# Altium schematic sheet Power.SchDoc
size A
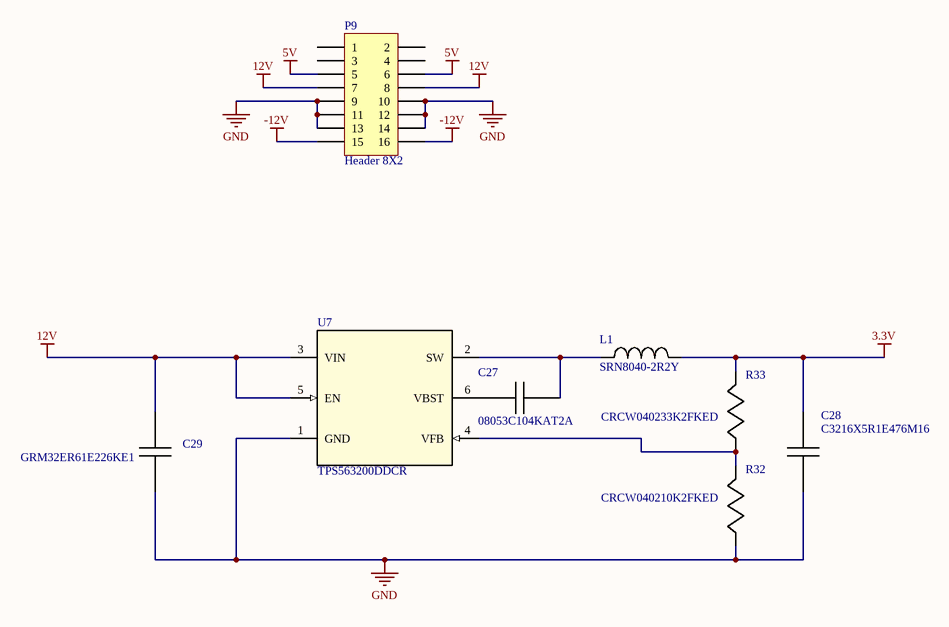
[diagram p0: Power.SchDoc]

## Parts
C27  08053C104KAT2A  [0805]
C28  C3216X5R1E476M16  [1206]
C29  GRM32ER61E226KE1  [1210]
L1  SRN8040-2R2Y  [SRN8040]
P9  Header 8X2  [HDR2X8]
R32  CRCW040210K2FKED  [0402]
R33  CRCW040233K2FKED  [0402]
U7  TPS563200DDCR  [DDC0006A]

## Nets
3.3V: C28.1 L1.2 R33.1
5V: P9.5 P9.6
12V: C29.1 P9.7 P9.8 U7.3(VIN) U7.5(EN)
-12V: P9.15 P9.16
GND: C28.2 C29.2 P9.9 P9.10 P9.11 P9.12 P9.13 P9.14 R32.2 U7.1(GND)
NetC27_1: C27.1 L1.1 U7.2(SW)
NetC27_2: C27.2 U7.6(VBST)
NetR32_1: R32.1 R33.2 U7.4(VFB)

Not connected (* = marked no-connect by the designer): P9 1 2 3 4

## Library data of the parts
C27 = 08053C104KAT2A: Imported; Vendor: AVX; Manufacturer_Part_Number: 08053C104KAT2A; Manufacturer_Name: AVX; RefDes: RefDes; TYPE: TYPE; Value: Value
C28 = C3216X5R1E476M16: Imported; Manufacturer_Part_Number: C3216X5R1E476M160AC; Manufacturer_Name: TDK; Cap_F: 0.000047; VDC_V: 25; RoHS: Y; MountType: SMT; RefDes: RefDes; TYPE: TYPE; Value: Value
C29 = GRM32ER61E226KE1: Imported; Manufacturer_Part_Number: GRM32ER61E226KE15L; Vendor: MuRata; Manufacturer_Name: MuRata; RefDes: RefDes; TYPE: TYPE; Value: Value
L1 = SRN8040-2R2Y: Imported; Vendor: Bourns; Type: DEV; Datasheet_URL: http://www.bourns.com/data/global/pdfs/SRN8040.pdf; Manufacturer_Part_Number: SRN8040-2R2Y; Manufacturer_Name: Bourns; RefDes: RefDes; Value: Value
P9 = Header 8X2: Header, 8-Pin, Dual row; LatestRevisionDate: 17-Jul-2002; LatestRevisionNote: Re-released for DXP Platform.; Publisher: Altium Limited
R32 = CRCW040210K2FKED: Imported; Vendor: Vishay-Dale; Manufacturer_Part_Number: CRCW040210K2FKED; Manufacturer_Name: Vishay-Dale; RefDes: RefDes; TYPE: TYPE; Value: Value
R33 = CRCW040233K2FKED: Imported; Vendor: Vishay-Dale; Manufacturer_Part_Number: CRCW040233K2FKED; Manufacturer_Name: Vishay-Dale; RefDes: RefDes; TYPE: TYPE; Value: Value
U7 = TPS563200DDCR: Imported; Alternate_Manufacturer: None; Manufacturer: Texas Instruments; CurrentTime: Not shown in title block; DocumentNumber: 1; SymbolCreator: a0411947; CompType: IC; U/M: EA; Designator: U?; PIN_COUNT: 6; CurrentDate: Not shown in title block; Time: Not shown in title block; Date: Not shown in title block; DocumentFullPathAndName: Not shown in title block; DocumentName: Not shown in title block; ModifiedDate: Not shown in title block; ApprovedBy: Not shown in title block; CheckedBy: Not shown in title block; Author: Not shown in title block; CompanyName: Not shown in title block; Engineer: Not shown in title block; Organization: Not shown in title block; Address1: Not shown in title block; Address2: Not shown in title block; Address3: Not shown in title block; Address4: Not shown in title block; Revision: Use project parameter SCH_Rev; SheetNumber: 1; SheetTotal: 1; ImagePath: Not shown in title block; Rule: *; ProjectName: *; SymbolVersion: 2014-04-11; PartNumber: TPS563200DDC; PackageReference: DDC0006A; MountType: SMT; ComponentLink1Description: Datasheet Link; ComponentLink1URL: https://sps06.itg.ti.com/sites/KMS/crossdivteams/altium/docs/ComponentDatasheets/TPS56320xDDC_User's_Guide_v0p1_14_0203.pdf; RoHS: Y; Publisher: Texas Instruments; LatestRevisionDate: 2014-04-14; Manufacturer_Part_Number: TPS563200DDCR; Manufacturer_Name: Texas Instruments; RefDes: RefDes; Type: DEV; Value: Value